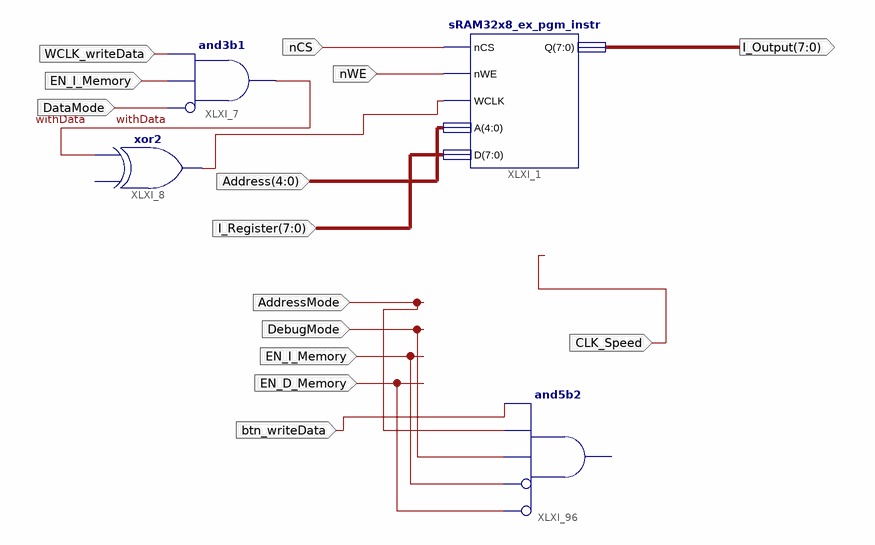
[diagram p0: schematic sheet 1]
// Xilinx ISE schematic I_Memory.sch (spartan3e) as structural Verilog: 4 symbols, 13 ports
module I_Memory (
  input  nCS,
  input  [4:0] Address,
  input  [7:0] I_Register,
  input  nWE,
  input  EN_I_Memory,
  input  WCLK_writeData,
  input  DataMode,
  input  btn_writeData,
  input  AddressMode,
  input  DebugMode,
  input  EN_D_Memory,
  input  CLK_Speed,
  output [7:0] I_Output
);

  wire withData, XLXN_26;

  sRAM32x8_ex_pgm_instr XLXI_1 (.nCS(nCS), .nWE(nWE), .WCLK(XLXN_26), .A(Address), .D(I_Register), .Q(I_Output));
  buf XLXI_8 (XLXN_26, withData);  // xor2 open: I0
  and XLXI_7 (withData, ~DataMode, EN_I_Memory, WCLK_writeData);  // and3b1
  // and5b2 XLXI_96 has open pins: I0=EN_D_Memory, I1=EN_I_Memory, I2=DebugMode, I3=AddressMode, I4=btn_writeData, O=open
endmodule
